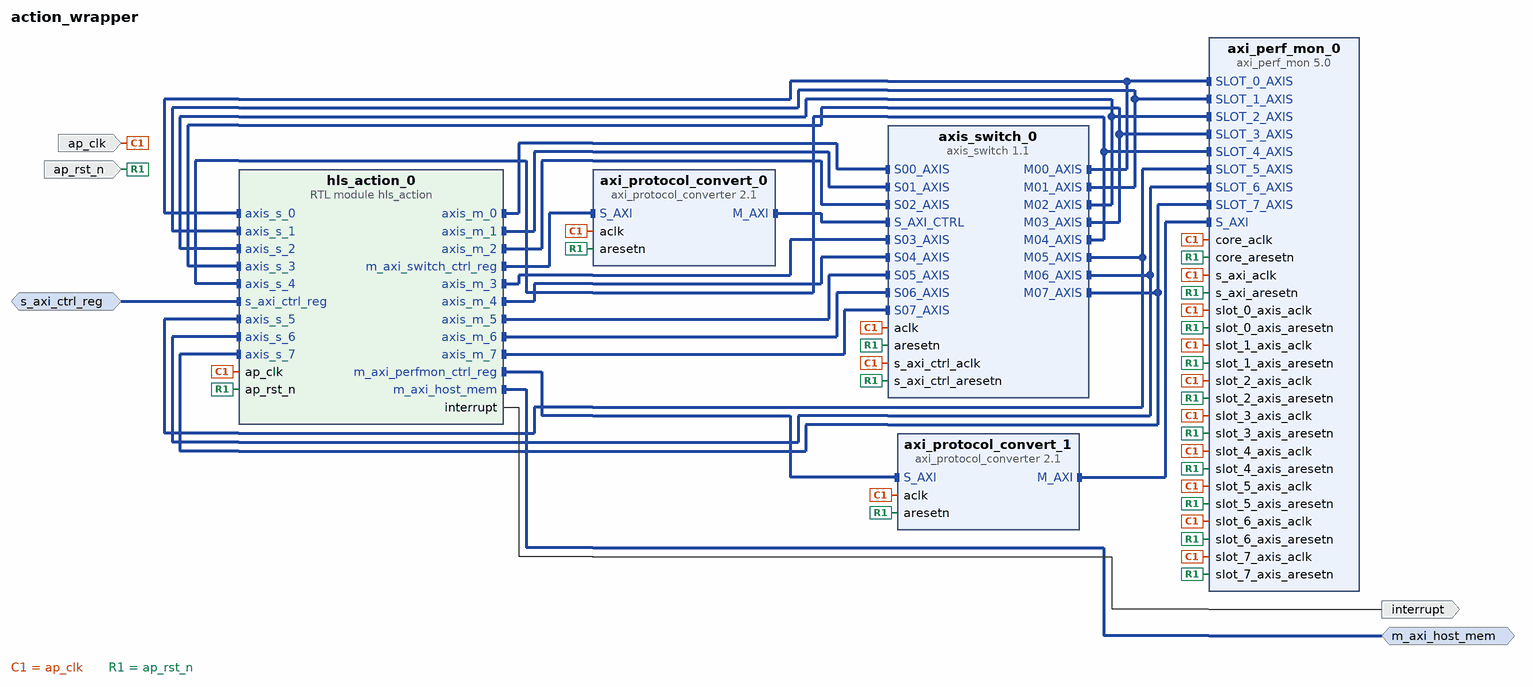
[diagram p0: block diagram of the top level]
# Vivado block design action_wrapper, xcku060-ffva1156-2-e, Vivado 2018.1
create_bd_design action_wrapper

create_bd_intf_port -mode Master -vlnv xilinx.com:interface:aximm_rtl:1.0 m_axi_host_mem
set_property -dict [list \
  CONFIG.DATA_WIDTH 512 \
  CONFIG.PROTOCOL AXI4 \
  CONFIG.ADDR_WIDTH 64 \
  CONFIG.NUM_READ_OUTSTANDING 2 \
  CONFIG.NUM_WRITE_OUTSTANDING 2 \
] [get_bd_intf_ports m_axi_host_mem]
create_bd_intf_port -mode Slave -vlnv xilinx.com:interface:aximm_rtl:1.0 s_axi_ctrl_reg
set_property -dict [list \
  CONFIG.DATA_WIDTH 32 \
  CONFIG.PROTOCOL AXI4LITE \
  CONFIG.ID_WIDTH 0 \
  CONFIG.ADDR_WIDTH 9 \
  CONFIG.AWUSER_WIDTH 0 \
  CONFIG.ARUSER_WIDTH 0 \
  CONFIG.WUSER_WIDTH 0 \
  CONFIG.RUSER_WIDTH 0 \
  CONFIG.BUSER_WIDTH 0 \
  CONFIG.READ_WRITE_MODE READ_WRITE \
  CONFIG.HAS_BURST 0 \
  CONFIG.HAS_LOCK 0 \
  CONFIG.HAS_PROT 0 \
  CONFIG.HAS_CACHE 0 \
  CONFIG.HAS_QOS 0 \
  CONFIG.HAS_REGION 0 \
  CONFIG.HAS_WSTRB 1 \
  CONFIG.HAS_BRESP 1 \
  CONFIG.HAS_RRESP 1 \
  CONFIG.SUPPORTS_NARROW_BURST 0 \
  CONFIG.NUM_READ_OUTSTANDING 1 \
  CONFIG.NUM_WRITE_OUTSTANDING 1 \
  CONFIG.MAX_BURST_LENGTH 1 \
  CONFIG.NUM_READ_THREADS 1 \
  CONFIG.NUM_WRITE_THREADS 1 \
  CONFIG.RUSER_BITS_PER_BYTE 0 \
  CONFIG.WUSER_BITS_PER_BYTE 0 \
] [get_bd_intf_ports s_axi_ctrl_reg]
create_bd_port -dir I -type clk ap_clk
create_bd_port -dir I -type rst ap_rst_n
create_bd_port -dir O -type intr interrupt

create_bd_cell -type module -reference hls_action hls_action_0
create_bd_cell -type ip -vlnv xilinx.com:ip:axis_switch:1.1 axis_switch_0
set_property -dict [list \
  CONFIG.NUM_SI 8 \
  CONFIG.NUM_MI 8 \
  CONFIG.ROUTING_MODE 1 \
  CONFIG.HAS_TREADY 1 \
  CONFIG.TDATA_NUM_BYTES 8 \
  CONFIG.HAS_TSTRB 1 \
  CONFIG.HAS_TLAST 1 \
  CONFIG.TID_WIDTH 0 \
  CONFIG.TDEST_WIDTH 0 \
  CONFIG.TUSER_WIDTH 0 \
  CONFIG.DECODER_REG 1 \
] [get_bd_cells axis_switch_0]
create_bd_cell -type ip -vlnv xilinx.com:ip:axi_perf_mon:5.0 axi_perf_mon_0
set_property -dict [list \
  CONFIG.C_SLOT_7_AXI_PROTOCOL AXI4S \
  CONFIG.C_SLOT_6_AXI_PROTOCOL AXI4S \
  CONFIG.C_SLOT_5_AXI_PROTOCOL AXI4S \
  CONFIG.C_SLOT_4_AXI_PROTOCOL AXI4S \
  CONFIG.C_SLOT_3_AXI_PROTOCOL AXI4S \
  CONFIG.C_SLOT_2_AXI_PROTOCOL AXI4S \
  CONFIG.C_SLOT_1_AXI_PROTOCOL AXI4S \
  CONFIG.C_SLOT_0_AXI_PROTOCOL AXI4S \
  CONFIG.C_NUM_OF_COUNTERS 10 \
  CONFIG.C_NUM_MONITOR_SLOTS 8 \
] [get_bd_cells axi_perf_mon_0]
create_bd_cell -type ip -vlnv xilinx.com:ip:axi_protocol_converter:2.1 axi_protocol_convert_0
create_bd_cell -type ip -vlnv xilinx.com:ip:axi_protocol_converter:2.1 axi_protocol_convert_1

# ---- connections ----

connect_bd_intf_net [get_bd_intf_pins axis_switch_0/M00_AXIS] [get_bd_intf_pins hls_action_0/axis_s_0]
connect_bd_intf_net [get_bd_intf_pins axis_switch_0/M00_AXIS] [get_bd_intf_pins axi_perf_mon_0/SLOT_0_AXIS]
connect_bd_intf_net [get_bd_intf_pins axis_switch_0/M01_AXIS] [get_bd_intf_pins hls_action_0/axis_s_1]
connect_bd_intf_net [get_bd_intf_pins axis_switch_0/M01_AXIS] [get_bd_intf_pins axi_perf_mon_0/SLOT_1_AXIS]
connect_bd_intf_net [get_bd_intf_pins axis_switch_0/M02_AXIS] [get_bd_intf_pins hls_action_0/axis_s_2]
connect_bd_intf_net [get_bd_intf_pins axis_switch_0/M02_AXIS] [get_bd_intf_pins axi_perf_mon_0/SLOT_2_AXIS]
connect_bd_intf_net [get_bd_intf_pins axis_switch_0/M03_AXIS] [get_bd_intf_pins hls_action_0/axis_s_3]
connect_bd_intf_net [get_bd_intf_pins axis_switch_0/M03_AXIS] [get_bd_intf_pins axi_perf_mon_0/SLOT_3_AXIS]
connect_bd_intf_net [get_bd_intf_pins axis_switch_0/M04_AXIS] [get_bd_intf_pins hls_action_0/axis_s_4]
connect_bd_intf_net [get_bd_intf_pins axis_switch_0/M04_AXIS] [get_bd_intf_pins axi_perf_mon_0/SLOT_4_AXIS]
connect_bd_intf_net [get_bd_intf_pins axis_switch_0/M05_AXIS] [get_bd_intf_pins hls_action_0/axis_s_5]
connect_bd_intf_net [get_bd_intf_pins axis_switch_0/M05_AXIS] [get_bd_intf_pins axi_perf_mon_0/SLOT_5_AXIS]
connect_bd_intf_net [get_bd_intf_pins axis_switch_0/M06_AXIS] [get_bd_intf_pins hls_action_0/axis_s_6]
connect_bd_intf_net [get_bd_intf_pins axis_switch_0/M06_AXIS] [get_bd_intf_pins axi_perf_mon_0/SLOT_6_AXIS]
connect_bd_intf_net [get_bd_intf_pins axis_switch_0/M07_AXIS] [get_bd_intf_pins hls_action_0/axis_s_7]
connect_bd_intf_net [get_bd_intf_pins axis_switch_0/M07_AXIS] [get_bd_intf_pins axi_perf_mon_0/SLOT_7_AXIS]
connect_bd_intf_net [get_bd_intf_pins hls_action_0/axis_m_0] [get_bd_intf_pins axis_switch_0/S00_AXIS]
connect_bd_intf_net [get_bd_intf_pins hls_action_0/axis_m_1] [get_bd_intf_pins axis_switch_0/S01_AXIS]
connect_bd_intf_net [get_bd_intf_pins hls_action_0/axis_m_2] [get_bd_intf_pins axis_switch_0/S02_AXIS]
connect_bd_intf_net [get_bd_intf_pins hls_action_0/axis_m_3] [get_bd_intf_pins axis_switch_0/S03_AXIS]
connect_bd_intf_net [get_bd_intf_pins hls_action_0/axis_m_4] [get_bd_intf_pins axis_switch_0/S04_AXIS]
connect_bd_intf_net [get_bd_intf_pins hls_action_0/axis_m_5] [get_bd_intf_pins axis_switch_0/S05_AXIS]
connect_bd_intf_net [get_bd_intf_pins hls_action_0/axis_m_6] [get_bd_intf_pins axis_switch_0/S06_AXIS]
connect_bd_intf_net [get_bd_intf_pins hls_action_0/axis_m_7] [get_bd_intf_pins axis_switch_0/S07_AXIS]
connect_bd_intf_net [get_bd_intf_pins hls_action_0/m_axi_perfmon_ctrl_reg] [get_bd_intf_pins axi_protocol_convert_1/S_AXI]
connect_bd_intf_net [get_bd_intf_pins hls_action_0/m_axi_switch_ctrl_reg] [get_bd_intf_pins axi_protocol_convert_0/S_AXI]
connect_bd_intf_net [get_bd_intf_pins axi_protocol_convert_0/M_AXI] [get_bd_intf_pins axis_switch_0/S_AXI_CTRL]
connect_bd_intf_net [get_bd_intf_pins axi_protocol_convert_1/M_AXI] [get_bd_intf_pins axi_perf_mon_0/S_AXI]
connect_bd_intf_net [get_bd_intf_ports m_axi_host_mem] [get_bd_intf_pins hls_action_0/m_axi_host_mem]
connect_bd_intf_net -intf_net s_axi_ctrl_reg_0_1 [get_bd_intf_ports s_axi_ctrl_reg] [get_bd_intf_pins hls_action_0/s_axi_ctrl_reg]
connect_bd_net -net ap_clk_0_1 [get_bd_ports ap_clk] \
  [get_bd_pins hls_action_0/ap_clk] [get_bd_pins axis_switch_0/aclk] [get_bd_pins axi_protocol_convert_0/aclk] \
  [get_bd_pins axi_protocol_convert_1/aclk] [get_bd_pins axi_perf_mon_0/core_aclk] \
  [get_bd_pins axi_perf_mon_0/slot_7_axis_aclk] [get_bd_pins axi_perf_mon_0/slot_6_axis_aclk] \
  [get_bd_pins axi_perf_mon_0/slot_5_axis_aclk] [get_bd_pins axi_perf_mon_0/slot_4_axis_aclk] \
  [get_bd_pins axi_perf_mon_0/slot_3_axis_aclk] [get_bd_pins axi_perf_mon_0/slot_2_axis_aclk] \
  [get_bd_pins axi_perf_mon_0/slot_1_axis_aclk] [get_bd_pins axi_perf_mon_0/slot_0_axis_aclk] \
  [get_bd_pins axi_perf_mon_0/s_axi_aclk] [get_bd_pins axis_switch_0/s_axi_ctrl_aclk]
connect_bd_net -net ap_rst_n_0_1 [get_bd_ports ap_rst_n] \
  [get_bd_pins hls_action_0/ap_rst_n] [get_bd_pins axi_perf_mon_0/core_aresetn] [get_bd_pins axi_protocol_convert_1/aresetn] \
  [get_bd_pins axis_switch_0/s_axi_ctrl_aresetn] [get_bd_pins axis_switch_0/aresetn] \
  [get_bd_pins axi_protocol_convert_0/aresetn] [get_bd_pins axi_perf_mon_0/s_axi_aresetn] \
  [get_bd_pins axi_perf_mon_0/slot_0_axis_aresetn] [get_bd_pins axi_perf_mon_0/slot_1_axis_aresetn] \
  [get_bd_pins axi_perf_mon_0/slot_2_axis_aresetn] [get_bd_pins axi_perf_mon_0/slot_3_axis_aresetn] \
  [get_bd_pins axi_perf_mon_0/slot_4_axis_aresetn] [get_bd_pins axi_perf_mon_0/slot_5_axis_aresetn] \
  [get_bd_pins axi_perf_mon_0/slot_6_axis_aresetn] [get_bd_pins axi_perf_mon_0/slot_7_axis_aresetn]
connect_bd_net [get_bd_pins hls_action_0/interrupt] [get_bd_ports interrupt]

# ---- address map ----
assign_bd_address -offset 0x0000000044A00000 -range 64K -target_address_space [get_bd_addr_spaces hls_action_0/m_axi_host_mem] [get_bd_addr_segs m_axi_host_mem/Reg]
assign_bd_address -offset 0x0000000044A00000 -range 64K -target_address_space [get_bd_addr_spaces hls_action_0/m_axi_perfmon_ctrl_reg] [get_bd_addr_segs axi_perf_mon_0/S_AXI/Reg]
assign_bd_address -offset 0x0000000044A00000 -range 64K -target_address_space [get_bd_addr_spaces hls_action_0/m_axi_switch_ctrl_reg] [get_bd_addr_segs axis_switch_0/S_AXI_CTRL/Reg]
assign_bd_address -offset 0x0000 -range 4K -target_address_space [get_bd_addr_spaces s_axi_ctrl_reg] [get_bd_addr_segs hls_action_0/s_axi_ctrl_reg/reg0]

validate_bd_design
save_bd_design
